# EasyEDA Pro project ProPrj_默语小智管家（ESP32版）_2025-03-15.epro, board PCB_默语小智管家ESP32开发板_彩色丝印
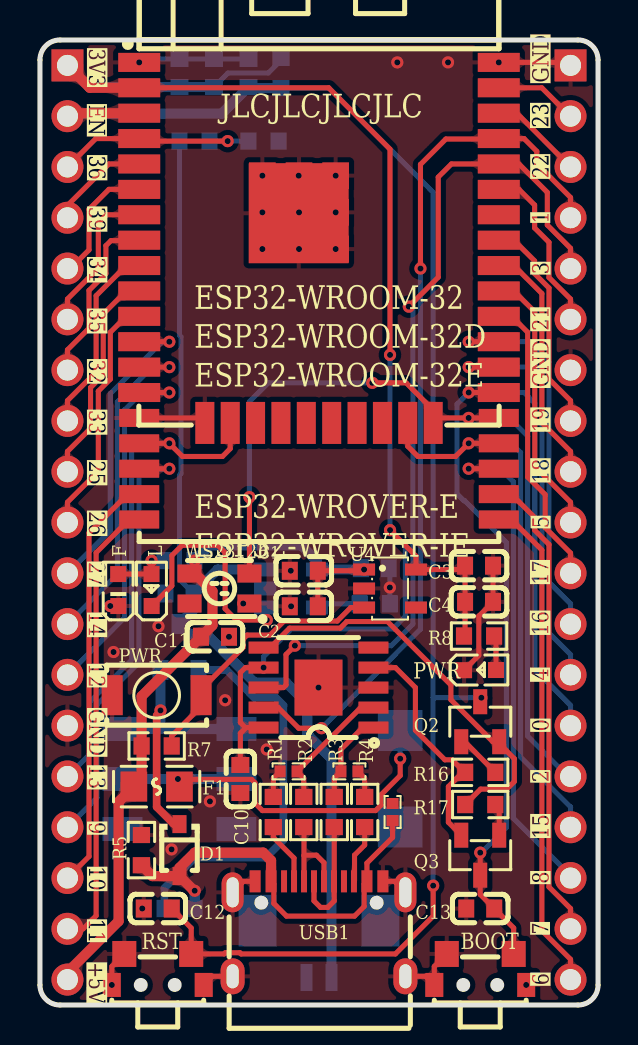
[diagram p7: board, top side]
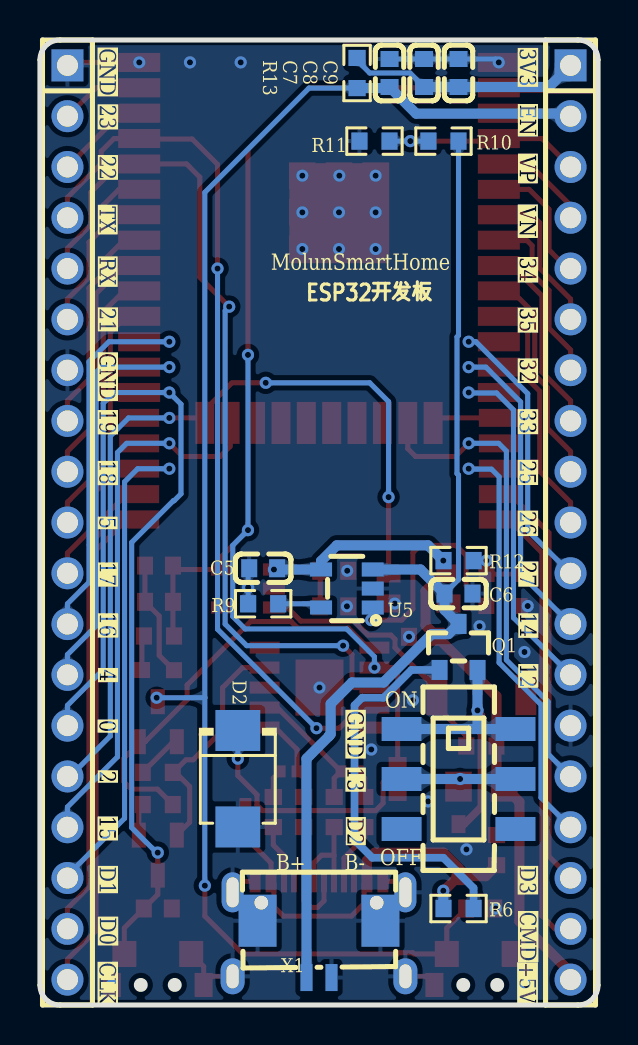
[diagram p8: board, bottom side, seen from below]

Outline 27.94 x 48.26 mm; copper layers: Top Layer, Bottom Layer. Coordinates in mm from the lower left corner of the outline.
Outline path: 0,47.26 0,1 arc(0.29,0.29) 1,0 26.94,0 arc(27.65,0.29) 27.94,1 27.94,47.26 arc(27.65,47.97) 26.94,48.26 1,48.26 arc(0.29,47.97) 0,47.26
Stack: Top Layer 0.035mm / Dielectric1 1.51mm FR4 er 4.5 / Bottom Layer 0.035mm

## Design rules (mm)
template: JLCPCB Capability(Two Layers Board)
spacing copperThickness1oz (default): track to track 0.102, other pairs 0.152 to 0.3
spacing copperThickness2oz: track to track 0.203, other pairs 0.152 to 0.3
track width copperThickness1oz (default): min 0.127, default 0.254, max 2.54
track width copperThickness2oz: min 0.203, default 0.254, max 2.54
differential pair differentialPair (default): width min 0.127, default 0.254, max 2.54; gap min 0.152, default 0.152
via viaSize (default): diameter min 0.5, default 0.61, max 10; hole min 0.3, default 0.305, max 6.3

## Placement (name value [footprint] x y rotation side)
BOOT1  TS24CA  [SW-SMD_TS24CA]  22.04 1.78 180 top
C1  10uF  [C0603]  13.21 21.72 0 top
C2  100nF  [C0603]  13.21 19.94 180 top
C3  10uF  [C0603]  21.98 21.97 180 top
C4  100nF  [C0603]  21.98 20.16 0 top
C5  4.7uF  [C0603]  16.76 21.84 180 bottom
C6  10uF  [C0603]  6.99 20.57 0 bottom
C7  100nF  [C0603]  10.44 46.61 270 bottom
C8  10uF  [C0603]  8.71 46.61 270 bottom
C9  100nF  [C0603]  6.99 46.61 90 bottom
C10  100nF  [C0603]  10.03 11.3 270 top
C11  100nF  [C0603]  8.76 18.42 180 top
C12  100nF  [C0603]  5.9 4.83 180 top
C13  100nF  [C0603]  22.04 4.83 180 top
CN1  PZ254V-11-19P  [HDR-TH_19P-P2.54-V-M]  1.38 24.13 270 bottom
CN2  PZ254V-11-19P  [HDR-TH_19P-P2.54-V-M]  26.56 24.13 270 bottom
D1  1N5819WS S4  [SOD-323_L1.6-W1.3-LS2.7-RD]  6.99 7.75 270 top
D2  SMBJ5339B  [SMB_L4.6-W3.6-LS5.4-RD]  18.03 11.32 270 bottom
F  XL-1608PGC-06  [LED0603-RD_GREEN]  3.92 20.75 90 top
F1  BSMD0805-050-6V  [F0805]  5.84 10.92 180 top
L  XL-1608SURC-06  [LED0603-RD_RED]  5.59 20.75 90 top
LED1  XL-1608SURC-06  [LED0603-RD_RED]  22.03 16.75 0 top
LED4  XL-3528RGBW-WS2812B  [LED-SMD_4P-L3.5-W2.8-BR-1]  8.99 20.83 0 top
ON  MST22D18G2 125  [SW-SMD_MST22D18G2]  6.99 11.3 270 bottom
PWR  TS-3425SG  [KEY-SMD_L3.9-W3.0-LS5.0_1]  5.84 15.49 0 top
Q1  AO3401A  [SOT-23_L2.9-W1.3-P1.90-LS2.4-BR]  6.99 17.91 270 bottom
Q2  SS8050  [SOT-23-3_L2.9-W1.3-P1.90-LS2.4-BR]  22.04 14.17 270 top
Q3  SS8050  [SOT-23-3_L2.9-W1.3-P1.90-LS2.4-BR]  22.04 7.49 90 top
R1  5.1kΩ  [R0603]  11.68 9.65 90 top
R2  33Ω  [R0603]  13.21 9.65 90 top
R3  33Ω  [R0603]  14.73 9.65 90 top
R4  5.1kΩ  [R0603]  16.26 9.65 90 top
R5  100kΩ  [R0603]  5.08 7.75 270 top
R6  100kΩ  [R0603]  6.99 4.83 180 bottom
R7  10kΩ  [R0603]  5.84 12.95 0 top
R8  4.7kΩ  [R0603]  21.98 18.45 0 top
R9  2kΩ  [R0603]  16.76 20.07 180 bottom
R10  300kΩ  [R0603]  7.74 43.2 0 bottom
R11  100kΩ  [R0603]  11.19 43.2 0 bottom
R12  1kΩ  [R0603]  6.99 22.22 0 bottom
R13  10kΩ  [R0603]  12.06 46.61 90 bottom
R16  10kΩ  [R0603]  22.04 11.63 0 top
R17  10kΩ  [R0603]  22.04 10.03 0 top
RST1  TS24CA  [SW-SMD_TS24CA]  5.9 1.78 180 top
U1  RCLAMP0521T-ES  [DFN1006-2L-BI]  17.65 9.65 270 top
U2  RCLAMP0521T-ES  [DFN1006-2L-BI]  12.45 11.68 0 top
U3  RCLAMP0521T-ES  [DFN1006-2L-BI]  15.49 11.68 180 top
U4  ME6217C33M5G  [SOT-23-5_L3.0-W1.7-P0.95-LS2.8-BR]  17.53 20.83 180 top
U5  TP4054  [TSOT-23-5_L2.9-W1.6-P0.95-LS2.8-BR]  12.57 20.83 180 bottom
U6  ESP32-WROOM-32D-N16  [WIFIM-SMD_39P-L25.5-W18.0-P1.27-BL]  13.97 38.12 270 top
U7  CH340K  [ESOP-10_L4.9-W3.9-P1.00-LS6.2-BL-EP]  13.94 15.88 90 top
U13  ESP32-WROVER-IE-N16R8  [WIFI-SMD_ESP32-WROVER-E]  13.97 35.71 0 top
USB1  TYPE-C 16PIN 2MD(073)  [USB-C-SMD_TYPE-C-6PIN-2MD-073]  13.97 3.81 0 top
X1  AFC12-S02DCA-00  [SMD_2P-P1.25]  13.97 2.79 0 bottom

## Footprints (pads in the part's own frame, mm; a bottom-side part is the same pattern mirrored in y, then rotated)
C0603
  rect 0.8x0.9 smd: 1(-0.7,0) 2(0.7,0)
DFN1006-2L-BI
  rect 0.55x0.6 smd: 1(-0.425,0) 2(0.425,0)
ESOP-10_L4.9-W3.9-P1.00-LS6.2-BL-EP
  rect 0.6x1.5 smd: 1(-2,-2.75) 2(-1,-2.75) 3(0,-2.75) 4(1,-2.75) 5(2,-2.75) 6(2,2.75) 7(1,2.75) 8(0,2.75) 9(-1,2.75) 10(-2,2.75)
  rect 2.8x2.4 smd: 11(0,0)
F0805
  rect 1.335x1.5 smd: 1(-1.143,0) 2(1.143,0)
HDR-TH_19P-P2.54-V-M
  rect 1.6x1.6 hole 1.05: 1(-22.86,0)
  round 1.6 hole 1.05: 2(-20.32,0) 3(-17.78,0) 4(-15.24,0) 5(-12.7,0) 6(-10.16,0) 7(-7.62,0) 8(-5.08,0) 9(-2.54,0) 10(0,0) 11(2.54,0) 12(5.08,0) 13(7.62,0) 14(10.16,0) 15(12.7,0) 16(15.24,0) 17(17.78,0) 18(20.32,0) 19(22.86,0)
KEY-SMD_L3.9-W3.0-LS5.0_1
  rect 1.05x2 smd: 1(-2.225,0) 2(2.225,0)
LED0603-RD_GREEN
  rect 0.8x0.8 smd: 1(-0.799,-0.004) 2(0.799,0.004)
LED0603-RD_RED
  rect 0.8x0.8 smd: 1(-0.799,-0.004) 2(0.799,0.004)
LED-SMD_4P-L3.5-W2.8-BR-1
  rect 1.2x0.9 smd: 1(1.5,-0.75) 2(1.5,0.75) 3(-1.5,0.75) 4(-1.5,-0.75)
R0603
  rect 0.806x0.864 smd: 1(-0.753,0) 2(0.753,0)
SMB_L4.6-W3.6-LS5.4-RD
  rect 2.047x2.241 smd: 1(-2.413,0) 2(2.413,0)
SMD_2P-P1.25
  rect 0.6x1.35 smd: 1(-0.625,1.421) 2(0.625,1.421)
  rect 1.9x2.6 smd: 3(-3.075,-1.421) 4(3.075,-1.421)
SOD-323_L1.6-W1.3-LS2.7-RD
  rect 0.9x0.7 smd: 1(-1.3,0) 2(1.3,0)
SOT-23-3_L2.9-W1.3-P1.90-LS2.4-BR
  rect 1.25x0.7 smd: 1(1,-0.95) 2(1,0.95) 3(-1,0)
SOT-23-5_L3.0-W1.7-P0.95-LS2.8-BR
  rect 1.1x0.6 smd: 1(1.3,-0.95) 2(1.3,0) 3(1.3,0.95) 4(-1.3,0.95) 5(-1.3,-0.95)
SOT-23_L2.9-W1.3-P1.90-LS2.4-BR
  rect 1x0.8 smd: 1(1.15,-0.95) 2(1.15,0.95) 3(-1.15,0)
SW-SMD_MST22D18G2
  rect 1.2x2 smd: 1(-2.5,2.85) 2(0,2.85) 3(2.5,2.85) 4(-2.5,-2.85) 5(0,-2.85) 6(2.5,-2.85)
SW-SMD_TS24CA
  rect 0.9x1.2 smd: 1(-2.3,0.775) 2(2.3,0.775)
  rect 1.2x1.3 smd: 3(-1.675,-0.775) 4(1.675,-0.775)
TSOT-23-5_L2.9-W1.6-P0.95-LS2.8-BR
  rect 1.1x0.7 smd: 1(1.294,-0.951) 2(1.294,-0.001) 3(1.294,0.951) 4(-1.294,0.951) 5(-1.294,-0.949)
USB-C-SMD_TYPE-C-6PIN-2MD-073
  rect 0.55x1.1 smd: 1(-3.2,2.375) 2(-2.4,2.375) 11(2.4,2.375) 12(3.2,2.375)
  rect 0.3x1.1 smd: 3(-1.75,2.375) 4(-1.25,2.375) 5(-0.75,2.375) 6(-0.25,2.375) 7(0.25,2.375) 8(0.75,2.375) 9(1.25,2.375) 10(1.75,2.375)
  oval 1.1x2 hole 0.6x1.5: 13(-4.325,1.825) 14(4.325,1.825)
  oval 1.2x1.8 hole 0.6x1.2: 13(-4.325,-2.375) 14(4.325,-2.375)
WIFI-SMD_ESP32-WROVER-E
  rect 2x0.9 smd: 1(-9,11.43) 2(-9,10.16) 3(-9,8.89) 4(-9,7.62) 5(-9,6.35) 6(-9,5.08) 7(-9,3.81) 8(-9,2.54) 9(-9,1.27) 10(-9,0) 11(-9,-1.27) 12(-9,-2.54) 13(-9,-3.81) 14(-9,-5.08) 15(-9,-6.35) 16(-9,-7.62) 17(-9,-8.89) 18(-9,-10.16) 19(-9,-11.43) 20(9,-11.43) 21(9,-10.16) 22(9,-8.89) 23(9,-7.62) 24(9,-6.35) 25(9,-5.08) 26(9,-3.81) 27(9,-2.54) 28(9,-1.27) 29(9,0) 30(9,1.27) 31(9,2.54) 32(9,3.81) 33(9,5.08) 34(9,6.35) 35(9,7.62) 36(9,8.89) 37(9,10.16) 38(9,11.43)
  rect 1.33x1.33 smd: 39(-2.835,5.765) 39(-2.835,3.93) 39(-2.835,2.095) 39(-1,5.765) 39(-1,3.93) 39(-1,2.095) 39(0.835,5.765) 39(0.835,3.93) 39(0.835,2.095)
WIFIM-SMD_39P-L25.5-W18.0-P1.27-BL
  rect 0.95x2.1 smd: 1(-9.015,-9) 2(-7.745,-9) 3(-6.475,-9) 4(-5.205,-9) 5(-3.935,-9) 6(-2.665,-9) 7(-1.395,-9) 8(-0.125,-9) 9(1.145,-9) 10(2.415,-9) 11(3.685,-9) 12(4.955,-9) 13(6.225,-9) 14(7.495,-9) 25(7.495,9) 26(6.225,9) 27(4.955,9) 28(3.685,9) 29(2.415,9) 30(1.145,9) 31(-0.125,9) 32(-1.395,9) 33(-2.665,9) 34(-3.935,9) 35(-5.205,9) 36(-6.475,9) 37(-7.745,9) 38(-9.015,9)
  rect 2.1x0.95 smd: 15(9.015,-5.715) 16(9.015,-4.445) 17(9.015,-3.175) 18(9.015,-1.905) 19(9.015,-0.635) 20(9.015,0.635) 21(9.015,1.905) 22(9.015,3.175) 23(9.015,4.445) 24(9.015,5.715)
  rect 5x5 smd: 39(-1.472,-1.017)

## Nets
As in the schematic, except:
GND: BOOT1.1 BOOT1.2 BOOT1.4 C1.1 C2.2 C3.1 C4.2 C5.1 C6.1 C7.1 C8.1 C9.2 C10.2 C11.1 C12.2 C13.2 CN1.14 CN2.1 CN2.7 D2.2 F.1 LED1.1 LED4.1 PWR.1 R1.2 R4.2 R5.1 R9.1 R11.2 RST1.1 RST1.2 RST1.4 U1.1 U2.1 U3.1 U4.2 U5.2 U6.1 U6.15 U6.38 U6.39 U7.3 U7.11 U13.1 U13.15 U13.38 U13.39 USB1.1 USB1.12 USB1.13 USB1.14 X1.1 X1.3 X1.4
$1N2026: PWR.2 R7.2 U4.3
$1N3808: F.2 L.2 R12.1
$1N3809: L.1 U5.1
$1N4189: D2.1 F1.1 ON.2 ON.5
$1N4190: D1.1 ON.1 ON.4 Q1.2

Pads without a net: LED4 4; ON 3 6; U4 4; U6 17 18 19 20 21 22 32; U7 5; U13 32; USB1 3 9

## Via types
v1: diameter 0.61, hole 0.305, Top Layer to Bottom Layer, 61 vias

## Routing (per net, layer and track width the routed paths; a pad name or vN(x,y) marks a point on that pad's centre or on a via; arc(x,y) is an arc through that point)
+5V: length 38.2
  Top Layer w0.254: C2.1 C1.2 16.16,21.72 v1(16.23,21.78) ; LED4.3 7.75,21.84 v1(7.75,22.22)
  Top Layer w0.508: LED4.3 7.76,21.58 8.64,20.7 8.64,18.99 C11.2 5.09,15.44 R7.1 5.09,11.31 F1.2 3.94,10.16 3.94,4.19 1.38,1.63 CN1.19
  Bottom Layer w0.508: C5.2 16,21.78 U5.4 13.87,22.2 13.08,22.99 8.51,22.99 v1(7.75,22.22)
GND: length 36.5
  Top Layer w0.254: RST1.1 8.63,1.44 USB1.13 ; USB1.1 10.19,6.19 USB1.13 ; U3.1 16.26,11.35 R4.2 ; U13.15 8,29.36 U6.15 ; R1.2 11.68,11.35 U2.1 ; v1(3.6,1) 3.6,1.93 4.22,2.55 ; USB1.12 17.75,6.19 USB1.14 ; C3.1 C4.2 21.97,19.45 21.97,17.48 LED1.1 ; v1(22.97,47.14) 26.41,47.14 CN2.1 ; 20.37,2.55 19.74,1.93 BOOT1.2 19.31,1.44 USB1.14
  Bottom Layer w0.254: R9.1 v1(17.52,20.88) 17.52,21.79 C5.1 ; C7.1 C8.1 C9.2 5.14,47.31 v1(4.97,47.14) ; X1.3 10.9,4.39 USB1.13 ; X1.4 18.29,5.47 USB1.14
  vias: v1(3.52,19.95) v1(3.68,17.65) v1(5.12,4.83) v1(5.93,18.94) v1(6.59,7.78) v1(8.51,10.18) v1(9.27,15.24) v1(9.46,18.42) v1(10.18,20.08) v1(11.13,41.47) v1(11.13,39.64) v1(11.13,37.81) v1(11.35,12.78) v1(12.56,21.72) v1(12.57,19.94) v1(12.95,41.48) v1(12.97,39.64) v1(12.97,37.81) v1(13.94,15.88) v1(14.81,41.47) v1(14.81,39.64) v1(14.81,37.81) v1(17.89,47.14) v1(20.43,47.14) v1(24.34,1)
VBUS: length 21.6
  Top Layer w0.254: USB1.2 11.71,6.05 11.71,5.08 12.34,4.44 15.75,4.44 16.23,4.93 16.23,6.05 USB1.11 16.37,7.1 17.65,8.38 U1.2
  Top Layer w0.508: D1.2 5.63,6.45 R5.2 ; D1.2 6.99,6.86 7.75,7.62 11.18,7.62 11.57,7.23 USB1.2 ; D1.2 7.72,5.72 v1(7.75,5.72)
  Bottom Layer w0.508: v1(7.75,5.72) 7.75,4.83 R6.1
VCC: length 77.4
  Top Layer w0.254: R8.1 21.28,18.51 C4.1 C3.2 21.09,21.78 U4.5 18.83,22.45 v1(17.53,23.75) ; C10.1 10.03,13.59 10.32,13.88 ; v1(11.19,16.88) 10.29,16.88 10.03,16.62 10.03,14.13 10.29,13.88 10.32,13.88 ; v1(17.53,32.51) 17.53,42.8 14.46,45.87 U6.2 ; 10.32,13.88 U7.10
  Top Layer w0.508: U6.2 2.5,45.87 CN1.1
  Bottom Layer w0.254: R13.2 12.06,47.24 11.43,46.61 9.41,46.61 C8.2 ; v1(11.19,16.88) 11.19,17.42 12.59,18.81 17.67,18.81 18.29,19.43 18.29,22.99 v1(17.53,23.75) v1(17.53,32.51)
  Bottom Layer w0.508: C8.2 C9.1 2.46,45.91 CN1.1
ASR_PA2: length 11
  Top Layer w0.254: U6.31 23.73,38.25 24.76,37.21 24.76,36.58 25.48,35.86 25.48,31.3 26.56,30.22 CN2.8
BAT+: length 51.1
  Bottom Layer w0.254: R10.1 6.99,33.49 7.06,33.41 7.06,26.58 6.99,26.5 6.99,21.27 C6.2
  Bottom Layer w0.508: X1.2 14.59,12.32 13.46,13.45 13.46,13.47 13.39,13.55 13.39,15.06 12.32,16.13 10.74,16.13 8.32,18.55 7.49,18.55 Q1.3 7.69,19.76 C6.2 8.89,21.78 U5.3
BAT_ADC: length 10.6
  Top Layer w0.254: CN1.3 2.8,43.33 U6.4 5.1,43.2 v1(9.4,43.2)
  Bottom Layer w0.254: R11.1 v1(9.4,43.2) R10.2
BOOT: length 52.5
  Top Layer w0.254: v1(21.46,30.63) U6.25 ; BOOT1.3 23.72,3.85 C13.1 22.04,5.53 Q3.3 v1(22.04,7.62)
  Bottom Layer w0.254: v1(22.04,7.62) 22.1,7.62 23.35,8.87 23.35,23.13 21.26,25.22 21.22,25.22 20.88,25.56 20.88,30.05 v1(21.46,30.63) 24.23,30.63 24.77,30.09 24.77,16.78 26.56,14.98 CN2.14
D+: length 4.6
  Top Layer w0.254: R3.2 14.73,11.35 U3.2 15.07,12.78 16.16,13.88 U7.1
D-: length 6.6
  Top Layer w0.254: U7.2 16.06,14.88 U2.2 13.21,11.35 R2.2
DTR: length 11.8
  Top Layer w0.254: U7.4 17.8,16.88 18.8,15.88 18.8,13.74 20.27,12.26 20.63,12.26 21.26,11.63 ; 21.26,11.63 21.16,11.63 20.45,10.92 20.45,9.14 Q3.2 ; 21.26,11.63 R16.1
EN: length 79.2
  Top Layer w0.254: v1(22.1,15.37) 22.1,15.22 Q2.3 ; C12.1 7.57,3.85 RST1.3 9.22,2.55 9.28,2.61 10.01,2.61 10.07,2.55 17.79,2.55 19.69,4.44 v1(19.69,5.97)
  Top Layer w0.508: U6.3 1.53,44.6 CN1.2
  Bottom Layer w0.254: 19.69,15.37 v1(22.1,15.37) ; 19.69,15.37 19.69,40.64 14.47,45.86 R13.1 ; 19.69,15.37 v1(19.69,5.97)
  Bottom Layer w0.508: CN1.2 1.5,44.58 9.11,44.58 C7.2 10.49,45.86 R13.1
IO1: length 44.2
  Top Layer w0.254: U7.9 11.92,14.88 12.95,13.84 v1(14.1,13.84) ; CN2.4 26.56,40.38 24.87,42.07 24.87,42.69 24.23,43.33 U6.35 22.95,43.31 20.32,43.31 19.05,42.04 v1(19.05,36.83)
  Bottom Layer w0.254: v1(19.05,36.83) 19.05,18.8 v1(14.1,13.84)
IO2: length 44.1
  Top Layer w0.254: LED4.2 v1(10.49,25.4) ; v1(16.64,31.11) 18.33,31.11 19.69,29.76 U6.24 19.94,29.36 v1(21.46,29.36) U13.24
  Bottom Layer w0.254: v1(10.49,25.4) 10.49,30.17 11.43,31.11 v1(16.64,31.11) ; v1(21.46,29.36) 23.5,29.36 24.42,28.45 24.42,13.45 26.44,11.43 CN2.15
IO3: length 43.3
  Top Layer w0.254: CN2.5 26.56,37.84 25.4,39.01 25.4,40.64 23.98,42.06 U6.34 20.6,42.06 19.94,41.4 19.94,36.4 v1(18.47,34.92) ; U7.8 12.19,15.88 12.32,16 12.32,17.53 v1(12.76,17.97)
  Bottom Layer w0.254: v1(12.76,17.97) 17.59,17.97 18.67,19.05 18.67,34.72 v1(18.47,34.92)
IO4: length 21
  Top Layer w0.254: v1(21.46,31.9) U6.26
  Bottom Layer w0.254: CN2.13 26.56,17.52 25.13,18.96 25.13,31.64 24.87,31.9 v1(21.46,31.9)
IO5: length 13.5
  Top Layer w0.254: CN2.10 26.56,25.14 24.77,26.94 24.77,34.66 23.73,35.71 U6.29
IO6: length 24.9
  Top Layer w0.254: CN2.19 26.56,2.28 25.13,3.72 25.13,22.75 23.6,24.28 U13.20
IO7: length 23.6
  Top Layer w0.254: CN2.18 26.56,4.82 25.48,5.9 25.48,23.03 24.76,23.75 24.76,24.38 23.6,25.55 U13.21
IO8: length 25
  Top Layer w0.254: v1(21.46,26.82) U13.22
  Bottom Layer w0.254: CN2.17 26.56,6.48 23.7,9.34 23.7,26.16 23.05,26.82 v1(21.46,26.82)
IO9: length 22.2
  Top Layer w0.254: 6.48,26.8 6.45,26.82 U13.17
  Bottom Layer w0.254: v1(6.48,26.82) 6.45,26.8 5.33,26.8 4.95,26.42 4.95,17.12 2.86,15.02 2.86,10.37 CN1.16
IO10: length 21
  Top Layer w0.254: U13.18 4.4,25.55 2.46,23.61 2.46,7.43 CN1.17
IO11: length 22.7
  Top Layer w0.254: CN1.18 2.16,3.81 2.81,4.46 2.81,22.62 4.47,24.28 U13.19
IO12: length 18.5
  Top Layer w0.254: v1(6.48,30.63) U6.14
  Bottom Layer w0.254: CN1.13 4.23,19.37 4.23,29.76 5.08,30.61 6.45,30.61 v1(6.48,30.63)
IO13: length 25.9
  Top Layer w0.254: U13.16 v1(6.48,28.09) 7.13,27.43 9.13,27.43 9.53,27.82 U6.16
  Bottom Layer w0.254: CN1.15 2.5,12.55 2.5,15.17 4.59,17.26 4.59,27.7 4.98,28.09 v1(6.48,28.09)
IO14: length 17
  Top Layer w0.254: v1(6.48,31.9) U6.13
  Bottom Layer w0.254: CN1.12 3.88,21.55 3.88,30.16 5.62,31.9 v1(6.48,31.9)
IO15: length 28.3
  Top Layer w0.254: 18.41,28.6 18.41,27.94 18.92,27.43 20.81,27.43 v1(21.46,28.09) U13.23
  Bottom Layer w0.254: CN2.16 26.56,9.9 24.06,12.41 24.06,27.63 23.6,28.09 v1(21.46,28.09)
IO16: length 19.5
  Top Layer w0.254: v1(21.46,33.17) U6.27
  Bottom Layer w0.254: v1(21.46,33.17) 24.49,33.17 25.48,32.17 25.48,21.14 26.56,20.06 CN2.12
IO17: length 14.7
  Top Layer w0.254: U6.28 23.25,34.16 23.9,34.16 24.42,33.64 24.42,26.41 25.29,25.53 25.29,23.87 26.56,22.6 CN2.11
IO18: length 12.2
  Top Layer w0.254: CN2.9 26.56,27.68 25.13,29.12 25.13,35.58 23.73,36.98 U6.30
IO21: length 8.6
  Top Layer w0.254: U6.33 23.98,40.79 24.76,40 24.76,38.86 25.48,38.14 25.48,36.38 26.56,35.3 CN2.6
IO22: length 4.7
  Top Layer w0.254: CN2.3 23.87,44.6 U6.36
IO23: length 4.2
  Top Layer w0.254: CN2.2 26.54,44.45 25.12,45.87 U6.37
IO25: length 10.9
  Top Layer w0.254: CN1.9 1.38,27.68 2.53,28.84 2.53,30.88 3.17,31.51 3.17,34.56 4.32,35.71 U6.10
IO26: length 12.2
  Top Layer w0.254: CN1.10 1.38,25.14 2.92,26.69 2.92,30.7 3.52,31.3 3.52,33.64 4.32,34.44 U6.11
IO27: length 15.4
  Top Layer w0.254: v1(6.48,33.17) U6.12
  Bottom Layer w0.254: v1(6.48,33.17) 6.12,33.17 3.52,30.57 3.52,23.73 CN1.11
IO32: length 8.8
  Top Layer w0.254: CN1.7 1.38,32.76 2.46,33.84 2.46,35.74 3.3,36.58 3.3,37.97 3.56,38.23 4.95,38.23 U6.8
IO33: length 9.6
  Top Layer w0.254: U6.9 4.32,36.98 2.81,35.47 2.81,31.66 1.38,30.22 CN1.8
IO34: length 6.4
  Top Layer w0.254: U6.6 3.45,40.79 2.46,39.79 2.46,37.76 1.52,36.83 CN1.5
IO35: length 7.7
  Top Layer w0.254: CN1.6 1.38,35.3 2.92,36.85 2.92,39.12 3.32,39.52 U6.7
IO39: length 5.1
  Top Layer w0.254: CN1.4 1.38,39.98 3.45,42.06 U6.5
RTS: length 20.5
  Top Layer w0.254: U7.6 11.53,17.88 12.5,18.85 15.03,18.85 15.36,19.18 17.4,19.18 20.57,16 20.57,15.27 22.67,13.17 Q2.2 22.99,13.08 23.75,12.32 23.75,11.18 23.37,10.8 22.06,10.8 R17.1
$1N1838: length 1.7
  Top Layer w0.254: R8.2 22.83,18.36 LED1.2
$1N2026: length 13.5
  Top Layer w0.254: U4.3 15.56,19.88 14.88,19.2 12.22,19.2 11.51,18.5 10.37,18.5 10.17,18.29 10.17,17.87 8.07,15.77 PWR.2 8.07,14.92 6.6,13.45 R7.2
$1N2778: length 2.3
  Top Layer w0.254: Q2.1 21.26,13.17 R16.2
$1N2780: length 1.6
  Top Layer w0.254: R17.2 22.99,9.83 Q3.1
$1N3301: length 4.8
  Top Layer w0.254: USB1.5 13.22,7.48 ; 13.22,7.48 13.24,7.49 13.84,7.49 14.22,7.12 USB1.7 ; 13.22,7.48 13.22,8.89 R2.1
$1N3302: length 6
  Top Layer w0.254: USB1.8 14.73,6.2 ; 14.73,6.2 R3.1 ; 14.73,6.2 14.73,5.21 14.41,4.88 14.05,4.88 13.72,5.21 USB1.6
$1N3308: length 2.9
  Top Layer w0.254: USB1.10 15.75,6.21 15.75,7.49 16.26,8 R4.1
$1N3309: length 3.1
  Top Layer w0.254: R1.1 11.68,8.38 12.72,7.35 USB1.4
$1N3808: length 3
  Top Layer w0.254: F.2 L.2 5.59,21.56 v1(5.59,22.22)
  Bottom Layer w0.254: v1(5.59,22.22) R12.1
$1N3809: length 11.8
  Top Layer w0.254: L.1 6.6,20.97 6.6,22.48 7.11,22.99 8.91,22.99 9.27,22.62 9.27,19.81 9.83,19.25 v1(11.36,19.25)
  Bottom Layer w0.254: 11.28,19.88 11.36,19.8 v1(11.36,19.25)
$1N3816: length 2.2
  Bottom Layer w0.254: R9.2 14.05,20.07 U5.5
$1N4189: length 21.4
  Top Layer w0.254: v1(6.91,11.3) 6.93,11.28 10.6,11.28 10.76,11.12 10.76,10.1 11.14,9.72 16.8,9.72 17.07,9.99 17.07,10.51 18.03,11.47 v1(18.03,12.32)
  Bottom Layer w0.254: v1(18.03,12.32) D2.1
  Bottom Layer w0.508: ON.2 v1(6.91,11.3) ON.5
$1N4190: length 15.1
  Top Layer w0.381: D1.1 6.7,9.05 5.84,9.91 5.84,14.48 6.1,14.73
  Bottom Layer w0.508: 6.03,13.8 6.04,13.81 ; 6.03,13.8 ON.4 ; 6.03,13.8 ON.1 ; Q1.2 v1(6.03,14.73) 6.03,13.81
$1N4194: length 19.7
  Bottom Layer w0.381: Q1.1 9.34,16.76 10.73,15.37 11.81,15.37 12.19,14.99 12.19,8.25 11.3,7.37 7.75,7.37 6.23,5.85 R6.2

## Copper pours and planes (outline as drawn; the poured copper is in the pictures)
GND on Top Layer: -2.92,50.42 30.48,50.42 30.48,-2.29 -2.92,-2.29
GND on Bottom Layer: -4.83,52.32 32.89,52.32 32.89,-4.83 -4.83,-4.83

Small or netless copper shapes (teardrops, artwork), in the pictures only: 222 on Top Layer, 92 on Bottom Layer

## Text on the board
Bottom Silkscreen Layer: ESP32开发板 | MolunSmartHome | 14 | CMD | 27 | 12 | EN | 3V3 | VP | VN | 34 | 35 | 32 | 33 | 25 | 26 | D3 | +5V | GND | 13 | D2 | 16 | D0 | 17 | 4 | 23 | 22 | TX | RX | 21 | 19 | 18 | 5 | 0 | 2 | 15 | D1 | CLK | ON | OFF | B- | B+
Top Silkscreen Layer: ESP32-WROOM-32 / ESP32-WROOM-32D / ESP32-WROOM-32E | ESP32-WROVER-E / ESP32-WROVER-IE | JLCJLCJLCJLC | WS2812B | PWR | RST | BOOT | 14 | 11 | 27 | 12 | EN | 3V3 | 36 | 39 | 34 | 35 | 32 | 33 | 25 | 26 | GND | 13 | 9 | 10 | +5V | 16 | 7 | 17 | 4 | 23 | 22 | 1 | 3 | 21 | 19 | 18 | 5 | 0 | 2 | 15 | 8 | 6
